# Altium schematic sheet ThrusterControl.SchDoc
size A
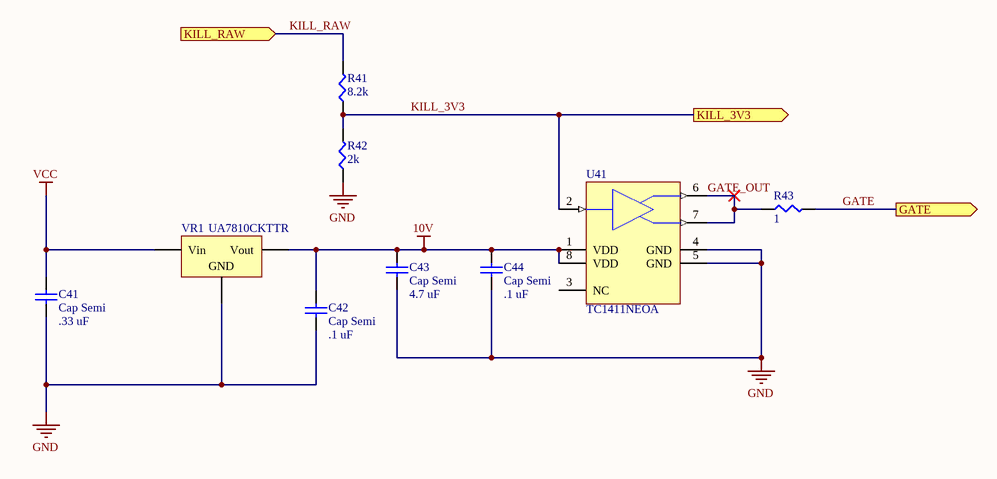
[diagram p0: ThrusterControl.SchDoc]

## Parts
C41  Cap Semi  value .33 uF  [C1206]
C42  Cap Semi  value .1 uF  [C1206]
C43  Cap Semi  value 4.7 uF  [C1206]
C44  Cap Semi  value .1 uF  [C1206]
R41  8.2k  [SMD-1206-RES]
R42  2k  [SMD-1206-RES]
R43  1  [SMD-1206-RES]
U41  TC1411NEOA  [SOIC-OA8_M]
VR1  UA7810CKTTR  [D2PAK_L]

## Ports
GATE (out), KILL_3V3 (out), KILL_RAW (in)

## Nets
10V: C42.2 C43.2 C44.2 U41.1(VDD) U41.8(VDD) VR1.3(Vout)
GND: C41.1 C42.1 C43.1 C44.1 R42.1 U41.4(GND) U41.5(GND) VR1.2(GND)
VCC: C41.2 VR1.1(Vin)
GATE: R43.2 ; port GATE
GATE_OUT: R43.1 U41.6(OUT) U41.7(OUT)
KILL_3V3: R41.1 R42.2 U41.2(IN) ; port KILL_3V3
KILL_RAW: R41.2 ; port KILL_RAW

Not connected (* = marked no-connect by the designer): U41 3(NC)

## Library data of the parts
C41-C44 = Cap Semi: Capacitor (Semiconductor SIM Model); Published: 8-Jun-2000; LatestRevisionDate: 29-May-2009; LatestRevisionNote: IPC-7351 Footprint Added.; PackageReference: C1206; Publisher: Altium Limited; PackageDescription: Chip Capacitor
R41 = ERJ-8ENF8201V: RES SMD 8.2K OHM 1% 1/4W 1206; Manufacturer: Panasonic Electronic Components; Factory Stock: 0; Unit Price (USD): 0.00933; @ qty: 1500; Minimum Quantity: 1; Power (Watts): 0.25W, 1/4W; Temperature Coefficient: ±100ppm/°C; Part Number: ERJ-8ENF8201V; Datasheets: http://industrial.panasonic.com/www-cgi/jvcr13pz.cgi?E+PZ+3+AOA0002+ERJ8ENF8201V+7+WW; Image: //media.digikey.com/Renders/Panasonic%20Renders/ERJ-1206%20Pkg.jpg; Digi-Key Part Number: P8.20KFCT-ND; Quantity Available: 54388; Packaging: Cut Tape (CT); Series: ERJ; Part Status: Active; Value: 8.2k; Tolerance: ±1%; Composition: Thick Film; Features: Automotive AEC-Q200; Operating Temperature: -55°C ~ 155°C; Package / Case: 1206 (3216 Metric); Supplier Device Package: 1206; Size / Dimension: 0.126" L x 0.063" W (3.20mm x 1.60mm); Height - Seated (Max): 0.028" (0.70mm); Number of Terminations: 2; Failure Rate: -
R42 = ERJ-P08J202V: RES SMD 2K OHM 5% 2/3W 1206; Manufacturer: Panasonic Electronic Components; Factory Stock: 0; Unit Price (USD): 0.02178; @ qty: 1500; Minimum Quantity: 1; Power (Watts): 0.667W, 2/3W; Temperature Coefficient: ±200ppm/°C; Part Number: ERJ-P08J202V; Datasheets: https://industrial.panasonic.com/cdbs/www-data/pdf/RDA0000/AOA0000C243.pdf; Image: //media.digikey.com/Renders/Panasonic%20Renders/ERJ-1206%20Pkg.jpg; Digi-Key Part Number: P2.0KALCT-ND; Quantity Available: 6794; Packaging: Cut Tape (CT); Series: ERJ; Part Status: Active; Value: 2k; Tolerance: ±5%; Composition: Thick Film; Features: Automotive AEC-Q200, Pulse Withstanding; Operating Temperature: -55°C ~ 155°C; Package / Case: 1206 (3216 Metric); Supplier Device Package: 1206; Size / Dimension: 0.126" L x 0.063" W (3.20mm x 1.60mm); Height - Seated (Max): 0.028" (0.70mm); Number of Terminations: 2; Failure Rate: -
R43 = ERJ-8BQF1R0V: RES SMD 1 OHM 1% 1/2W 1206; Manufacturer: Panasonic Electronic Components; Factory Stock: 0; Unit Price (USD): 0.05778; @ qty: 1500; Power (Watts): 0.5W, 1/2W; Temperature Coefficient: ±200ppm/°C; Part Number: ERJ-8BQF1R0V; Datasheets: https://industrial.panasonic.com/cdbs/www-data/pdf/RDA0000/AOA0000C239.pdf; Image: //media.digikey.com/Renders/Panasonic%20Renders/ERJ-1206%20Pkg.jpg; Digi-Key Part Number: P17600CT-ND; Quantity Available: 2046; Minimum Quantity: 1; Packaging: Cut Tape (CT); Series: ERJ; Part Status: Active; Value: 1; Tolerance: ±1%; Composition: Thick Film; Features: Automotive AEC-Q200, Current Sense; Operating Temperature: -55°C ~ 125°C; Package / Case: 1206 (3216 Metric); Supplier Device Package: 1206; Size / Dimension: 0.126" L x 0.063" W (3.20mm x 1.60mm); Height - Seated (Max): 0.028" (0.70mm); Number of Terminations: 2; Failure Rate: -
U41 = CMP-0137-00255-1: 1A High-Speed MOSFET Driver, Non-Inverting, Industrial Temperature; Code_IPC: SOIC127P600-8; DatasheetVersion: revD, Sep-2006; PackageVersion: revBB, Aug-2009; PackageDescription: 8-Lead Plastic Small Outline (OA) - Narrow, 3.90mm Body [SOIC]; PackageReference: SOIC-OA8
VR1 = Volt Reg: Voltage Regulator; Published: 24-Mar-1999; LatestRevisionDate: 29-May-2009; LatestRevisionNote: IPC-7351 Footprint Added.; PackageReference: D2PAK; Publisher: Altium Limited; PackageDescription: 3-Pin Transistor Outline Package 2.54 mm Pitch, 15.1 mm Lead Span